# Altium schematic sheet Mellon-1.SchDoc
size 594 x 420 mm; ApprovedBy: Лазарев В.П.; DrawnBy: Лазарев В.П.; SheetTotal: 1; PageSetup: Record=PageOptions|CenterHorizontal=True|CenterVertical=True|PrintScale=1.00|XCorrection=1.00|YCorrection=1.00|PrintKind=0|BorderSize=5000000|LeftOffset=0|BottomOffset=0|Orientation=2|PaperLength=1000|PaperWidth=1000|Scale=100|PaperSource=260|PrintQuality=600|MediaType=1|DitherType=10|PaperKind=A3|PrintScaleMode=0
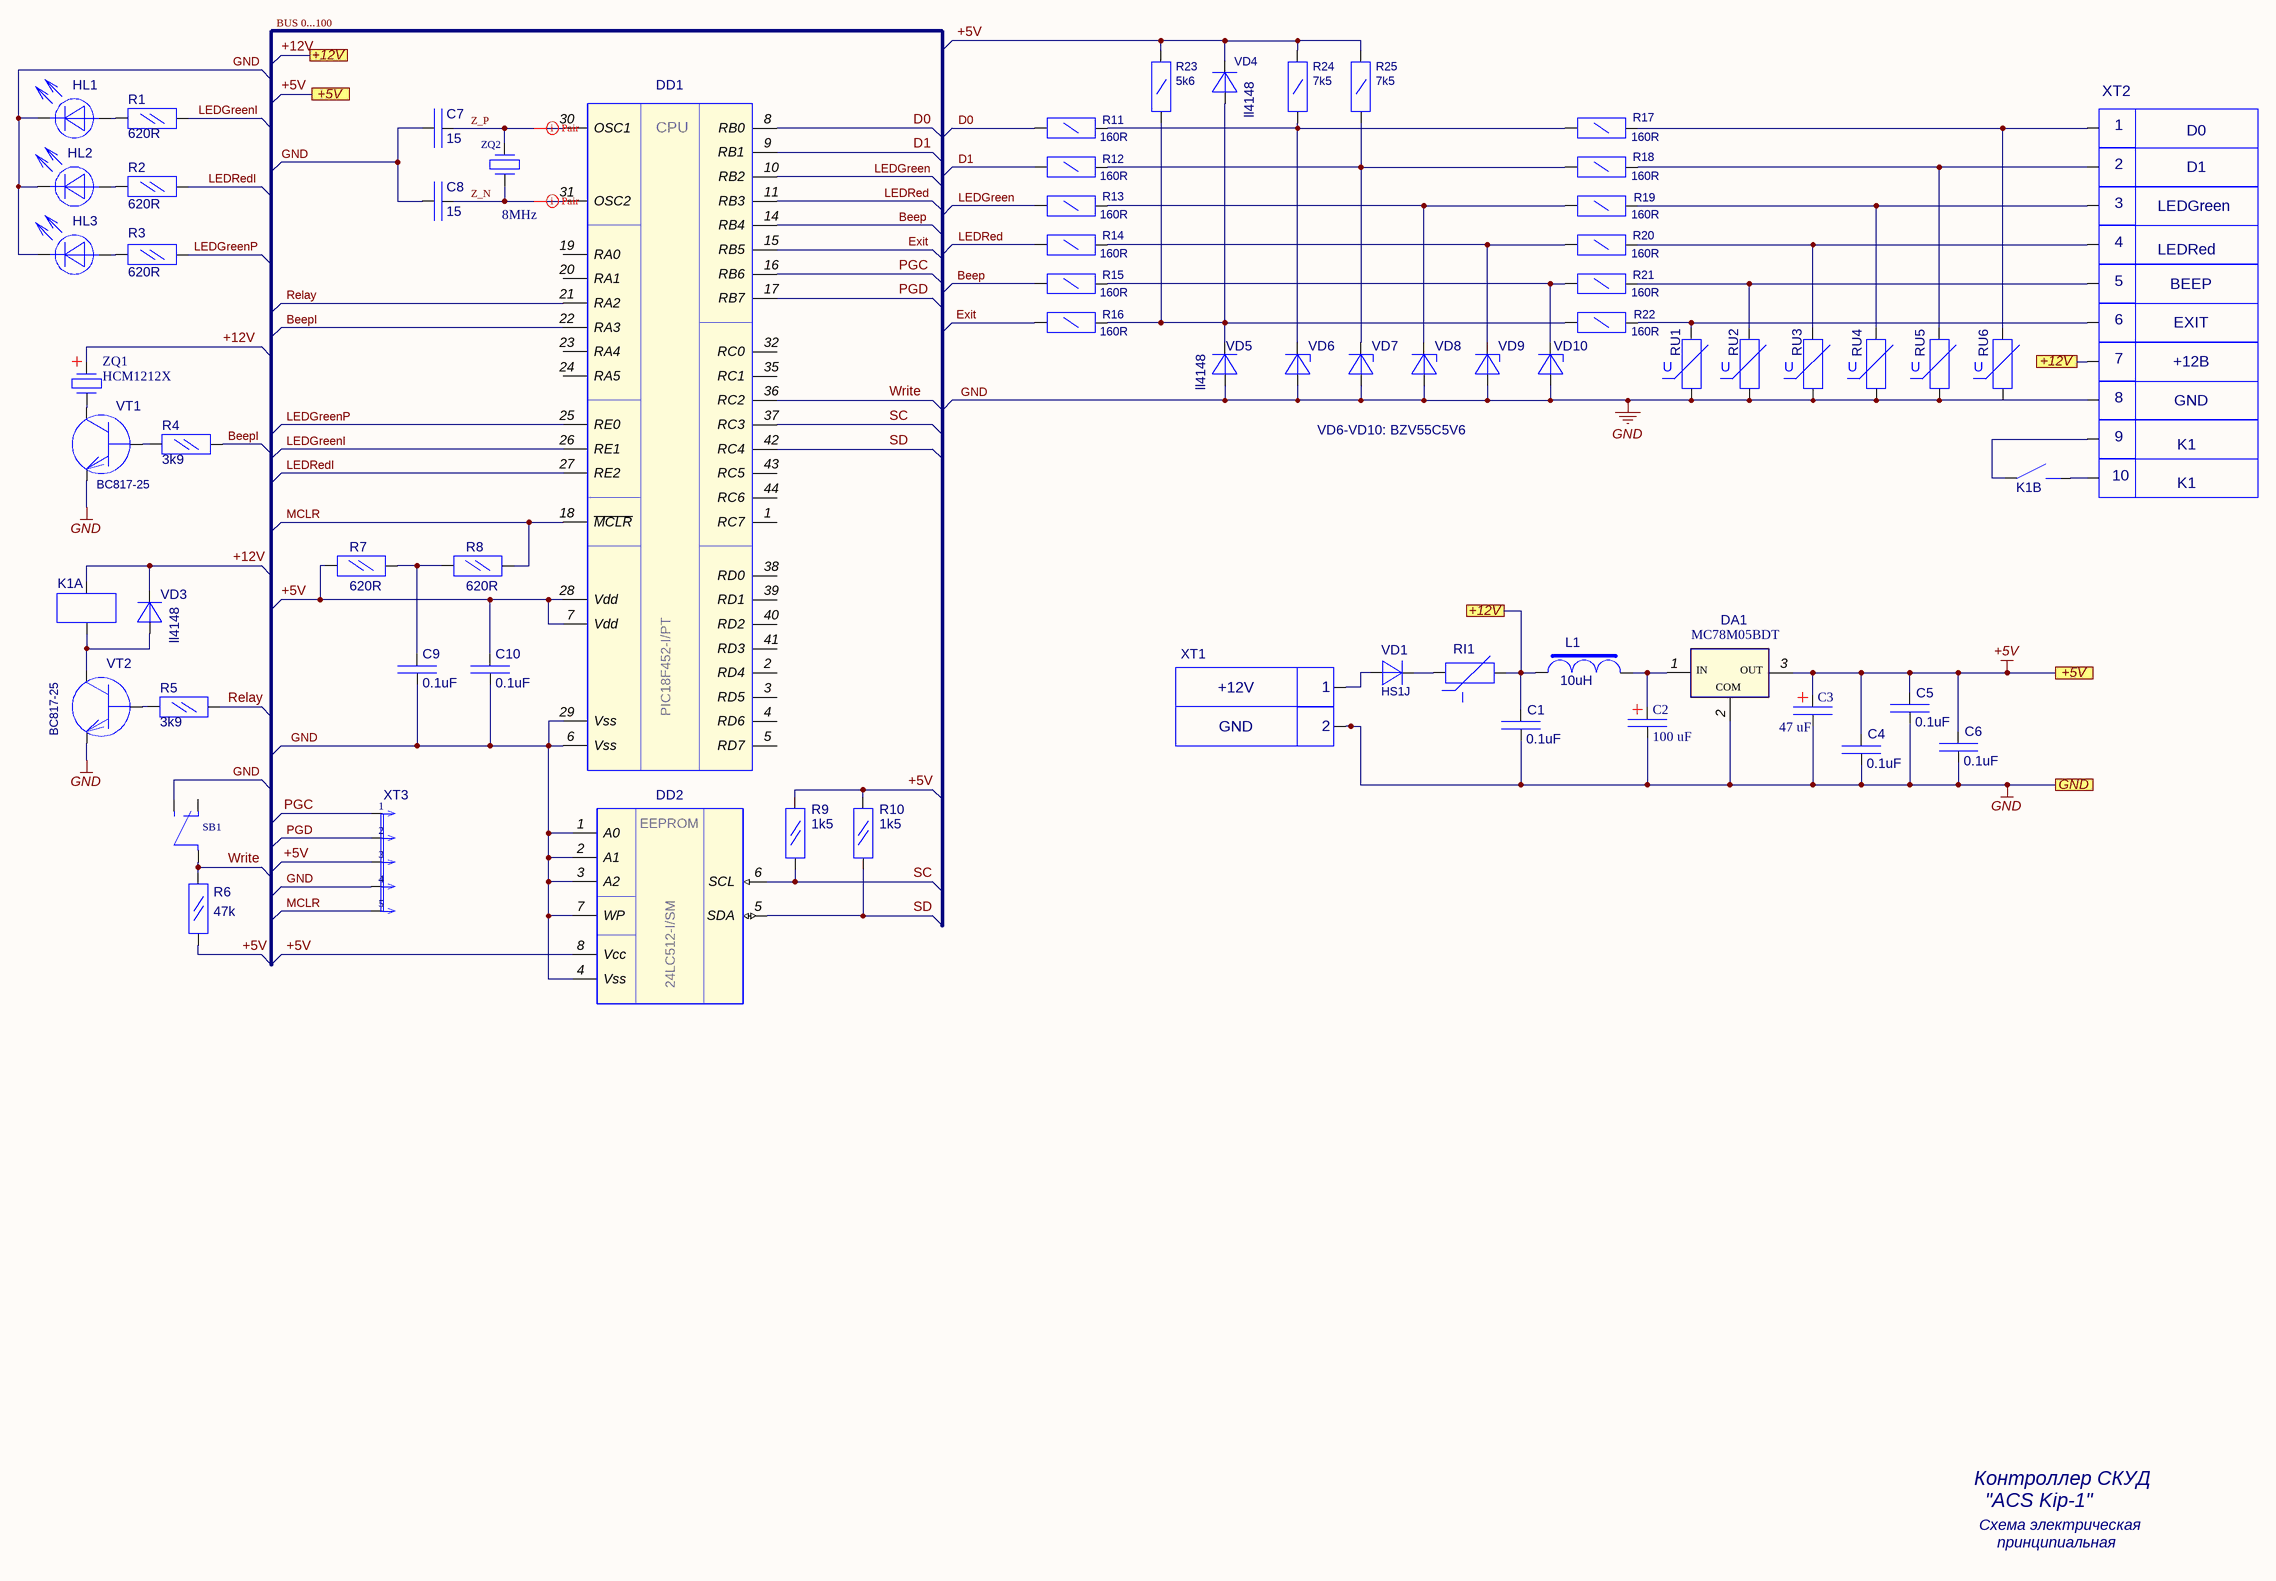
[diagram p0: Mellon-1.SchDoc]

## Parts
C1  value 0.1uF  [CAPC2012 (0805)]  (hidden comment: Cap1)
C2  value 100 uF  [CAPR E 6.5x12, pitch 2.5]  (hidden comment: Comment)
C3  value 47 uF  [CAPR E 6.5x12, pitch 2.5]  (hidden comment: Comment)
C4  value 0.1uF  [CAPC2012 (0805)]  (hidden comment: Cap1)
C5  value 0.1uF  [CAPC2012 (0805)]  (hidden comment: Cap1)
C6  value 0.1uF  [CAPC2012 (0805)]  (hidden comment: Cap1)
C7  value 15  [1608[0603]]  (hidden comment: Cap_SMD)
C8  value 15  [1608[0603]]  (hidden comment: Cap_SMD)
C9  value 0.1uF  [CAPC2012 (0805)]  (hidden comment: Cap_SMD)
C10  value 0.1uF  [CAPC2012 (0805)]  (hidden comment: Cap_SMD)
DA1  MC78M05BDT  [D3PAK]
DD1  PIC18F452-I/PT  [TQFP-PT44_M]
DD2  24LC512-I/SM  [SO8_W]
HL1  LED Green  [LED Green smd-1206]  (value not drawn)
HL2  LED Red  [LED Red smd-1206]  (value not drawn)
HL3  LED Green  [LED Green smd-1206]  (value not drawn)
K1  Relay  [Relay TRC-12VDC-SB-AL]  (value not drawn)  (parts A,B of 2)
L1  Inductance: 10uH  [Choke SMD 1812]  (hidden comment: Choke SMD)
R1  value 620R  [RESC2012(0805)]  (hidden comment: Res 1/8W)
R2  value 620R  [RESC2012(0805)]  (hidden comment: Res 1/8W)
R3  value 620R  [RESC2012(0805)]  (hidden comment: Res 1/8W)
R4  value 3k9  [RESC2012(0805)]  (hidden comment: Res 1/8W)
R5  value 3k9  [RESC2012(0805)]  (hidden comment: Res 1/8W)
R6  value 47k  [RESC2012(0805)]  (hidden comment: Res 1/8W)
R7  value 620R  [RESC2012(0805)]  (hidden comment: Res 1/8W)
R8  value 620R  [RESC2012(0805)]  (hidden comment: Res 1/8W)
R9  value 1k5  [RESC2012(0805)]  (hidden comment: Res 1/8W)
R10  value 1k5  [RESC2012(0805)]  (hidden comment: Res 1/8W)
R11  value 160R  [RESC3216(1206)N]  (hidden comment: Res 1/4W)
R12  value 160R  [RESC3216(1206)N]  (hidden comment: Res 1/4W)
R13  value 160R  [RESC3216(1206)N]  (hidden comment: Res 1/4W)
R14  value 160R  [RESC3216(1206)N]  (hidden comment: Res 1/4W)
R15  value 160R  [RESC3216(1206)N]  (hidden comment: Res 1/4W)
R16  value 160R  [RESC3216(1206)N]  (hidden comment: Res 1/4W)
R17  value 160R  [RESC3216(1206)N]  (hidden comment: Res 1/4W)
R18  value 160R  [RESC3216(1206)N]  (hidden comment: Res 1/4W)
R19  value 160R  [RESC3216(1206)N]  (hidden comment: Res 1/4W)
R20  value 160R  [RESC3216(1206)N]  (hidden comment: Res 1/4W)
R21  value 160R  [RESC3216(1206)N]  (hidden comment: Res 1/4W)
R22  value 160R  [RESC3216(1206)N]  (hidden comment: Res 1/4W)
R23  value 5k6  [RESC3216(1206)N]  (hidden comment: Res 1/4W)
R24  value 7k5  [RESC3216(1206)N]  (hidden comment: Res 1/4W)
R25  value 7k5  [RESC3216(1206)N]  (hidden comment: Res 1/4W)
RI1  MF-MSMF010  [Multy_Fuse 1812]  (value not drawn)
RU1  Varistor  [CAPC3216N]  (value not drawn)
RU2  Varistor  [CAPC3216N]  (value not drawn)
RU3  Varistor  [CAPC3216N]  (value not drawn)
RU4  Varistor  [CAPC3216N]  (value not drawn)
RU5  Varistor  [CAPC3216N]  (value not drawn)
RU6  Varistor  [CAPC3216N]  (value not drawn)
SB1  SW-2WAY_Gost  [PLS 2pin]  (value not drawn)
VD1  value HS1J  [CD4532-1812 (mod)]  (hidden comment: Diode1)
VD3  value ll4148  [MELF-D3516-1406]  (hidden comment: Diode LL4148)
VD4  value ll4148  [MELF-D3516-1406]  (hidden comment: Diode LL4148)
VD5  value ll4148  [MELF-D3516-1406]  (hidden comment: Diode LL4148)
VD6  Diode Zener  [SOD80 (miniMELF]  (value not drawn)
VD7  Diode Zener  [SOD80 (miniMELF]  (value not drawn)
VD8  Diode Zener  [SOD80 (miniMELF]  (value not drawn)
VD9  Diode Zener  [SOD80 (miniMELF]  (value not drawn)
VD10  Diode Zener  [SOD80 (miniMELF]  (value not drawn)
VT1  value BC817-25  [SOT-23_3D]  (hidden comment: BC847)
VT2  value BC817-25  [SOT-23_3D]  (hidden comment: BC847)
X2.2  Connect x2_1  [ZIP-Ballast2 - screw 3.5]  (value not drawn)
XT1  Connect x2_1  [ZIP-Ballast2]  (value not drawn)
XT2  Connect x2  [ZIP-Ballast2 - screw 3.5]  (value not drawn)
XT2.1  Connect x2_1  [ZIP-Ballast2 - screw 3.5]  (value not drawn)
XT2.3  Connect x2_1  [ZIP-Ballast2 - screw 3.5]  (value not drawn)
XT2.4  Connect x2_1  [ZIP-Ballast2]  (value not drawn)
XT3  Connect x5  [Connector PLS 5pin]  (value not drawn)
ZQ1  value HCM1212X  [HCM1606X]  (hidden comment: Buzzer)
ZQ2  value 8MHz  [HC-49sm]  (hidden comment: XTAL_1)

## Ports
+5V, +12V, GND

## Nets
+5V: C3.1 C4.2 C5.2 C6.2 C10.2 DA1.3(OUT) DD1.7(Vdd) DD1.28(Vdd) DD2.8(Vcc) R6.2 R7.2 R9.1 R10.1 R23.1 R24.1 R25.1 VD4.2 XT3.3 ; port +5V
GND: C1.1 C2.2 C3.2 C4.1 C5.1 C6.1 C7.1 C8.1 C9.1 C10.1 DA1.2(COM) DD1.6(Vss) DD1.29(Vss) DD2.1(A0) DD2.2(A1) DD2.3(A2) DD2.4(Vss) DD2.7(WP) HL1.2 HL2.2 HL3.2 RU1.1 RU2.1 RU3.1 RU4.1 RU5.1 RU6.1 SB1.2(NO) VD5.1 VD6.1 VD7.1 VD8.1 VD9.1 VD10.1 VT1.2(E) VT2.2(E) XT1.2 XT2.3.2 XT3.4 ; port GND
+12V: C1.2 K1.4 L1.2 RI1.1 VD3.2 XT2.3.1 ZQ1.1(OSC1) ; port +12V
Beep: DD1.14(RB4) R15.2
BeepI: DD1.22(RA3) R4.2
D0: DD1.8(RB0) R11.2
D1: DD1.9(RB1) R12.2
Exit: DD1.15(RB5) R16.2
LEDGreen: DD1.10(RB2) R13.2
LEDGreenI: DD1.26(RE1) R1.2
LEDGreenP: DD1.25(RE0) R3.2
LEDRed: DD1.11(RB3) R14.2
LEDRedI: DD1.27(RE2) R2.2
MCLR: DD1.18(~{MCLR}) R8.1 XT3.5
PGC: DD1.16(RB6) XT3.1
PGD: DD1.17(RB7) XT3.2
Relay: DD1.21(RA2) R5.2
SC: DD1.37(RC3) DD2.6(SCL) R9.2
SD: DD1.42(RC4) DD2.5(SDA) R10.2
Write: DD1.36(RC2) R6.1 SB1.1(C)
Z_N: C8.2 DD1.31(OSC2) ZQ2.1(OSC1)
Z_P: C7.2 DD1.30(OSC1) ZQ2.2(OSC2)
NetC2_1: C2.1 DA1.1(IN) L1.1
NetC9_2: C9.2 R7.1 R8.2
NetHL1_1: HL1.1 R1.1
NetHL2_1: HL2.1 R2.1
NetHL3_1: HL3.1 R3.1
NetK1_1: K1.1 XT2.4.1
NetK1_2: K1.2 XT2.4.2
NetK1_3: K1.3 VD3.1 VT2.3(C)
NetR4_1: R4.1 VT1.1(B)
NetR5_1: R5.1 VT2.1(B)
NetR11_1: R11.1 R17.2 R24.2 VD6.2
NetR12_1: R12.1 R18.2 R25.2 VD7.2
NetR13_1: R13.1 R19.2 VD8.2
NetR14_1: R14.1 R20.2 VD9.2
NetR15_1: R15.1 R21.2 VD10.2
NetR16_1: R16.1 R22.2 R23.2 VD4.1 VD5.2
NetR17_1: R17.1 RU6.2 XT2.1
NetR18_1: R18.1 RU5.2 XT2.2
NetR19_1: R19.1 RU4.2 XT2.1.1
NetR20_1: R20.1 RU3.2 XT2.1.2
NetR21_1: R21.1 RU2.2 X2.2.1
NetR22_1: R22.1 RU1.2 X2.2.2
NetRI1_2: RI1.2 VD1.2
NetVD1_1: VD1.1 XT1.1
NetVT1_3: VT1.3(C) ZQ1.2(OSC2)

Not connected (* = marked no-connect by the designer): DD1 1(RC7) 2(RD4) 3(RD5) 4(RD6) 5(RD7) 19(RA0) 20(RA1) 23(RA4) 24(RA5) 32(RC0) 35(RC1) 38(RD0) 39(RD1) 40(RD2) 41(RD3) 43(RC5) 44(RC6); SB1 3(NC)

## Buses and harness runs
bus BUS 0...100

## Layout directives
differential pair: Z_N, Z_P

## Notes on the sheet
- (near XT2) 1
- D0
- (near XT2) 2
- (near XT2.1) 3
- LEDGreen
- D1
- (near XT2.1) 4
- LEDRed
- (near X2.2) 5
- (near X2.2) 6
- EXIT
- BEEP
- (near XT2.3) 7
- +12B
- VD6-VD10: BZV55C5V6
- (near XT2.3) 8
- (near XT2.4) 9
- K1
- GND
- (near XT2.4) 10
- +12V
- (near XT1) 1
- (near XT1) 2
- Контроллер СКУД
  "ACS Kip-1"
- Схема электрическая
  принципиальная
- Подп. дата
- Инв. № дубл.
- Взам. инв. №
- Подп. и дата
- Изм.
- Лист.
- № докум.
- Подп.
- Дата
- Лит.
- Масса
- Масштаб
- Разраб.
- Пров.
- Т. контр.
- Лист 1
- Листов
- 1:1
- Инв. № подп.
- Н. контр.
- Утв.
- Формат А2
- (in symbol PIC18F452-I/PT) CPU
- (in symbol Varistor) U

## Library data of the parts
C1 C4-C6 = Cap1: Capacitor GOST; Voltage: 100 V; Function: CVCC; Dielectric: Y5V; Tolerance: 5%/10%; PackageDescription: Chip Capasitor; Package Reference: C0805
C2 = Cap Pol: Cap Pol GOST; Tolerance: 10%; Function: Electrolytic Aluminum Capasitor; Voltage: 35V; Supplier: *; PackageDescription: Radial, Thru-Hole Body 13.0x25.0 (DxH)mm, Pin Spacing 5.0mm
C3 = Cap Pol: Cap Pol GOST; Tolerance: 10%; Function: Electrolytic Aluminum Capasitor; Voltage: 16V; Supplier: *; PackageDescription: Radial, Thru-Hole Body 13.0x25.0 (DxH)mm, Pin Spacing 5.0mm
C7 C8 = Cap_SMD: Ceramic; Voltage: 15V; Tolerance %: 1%; Dielectric: NPO; Value2: 220-470nF; PackageDescription: SMD CC0603; Function: *; Supplier: *; Supplier Part Number: *
C9 C10 = Cap_SMD: Ceramic; Voltage: 15V; Tolerance %: 10%; Dielectric: Y5V; Value2: 220-470nF; PackageDescription: SMD CC0805; Function: *; Supplier: *; Supplier Part Number: *
DA1 = MC78M05BDT: Voltage Regulator Gost; Functuion: Positive Voltage Regulator; Value: MC78M05BDT; PackageReference: *
DD1 = PIC18F452-I/PT: 44pin TQFP; Functuion: MCU; PackageReference: TQFP; Supplier 1: Microchip Technology Inc; Value: PIC18F452-I/PT
DD2 = 24LC512-I/SM: Function: EEPROM; Supplier: Microchip Technology Inc; Value: 24LC512-I/SM
HL1 HL3 = LED Green: LED Gost; Value: KA-3021SGC; PackageDescription: SMD 2x3mm; Color: Green
HL2 = LED Red: LED Gost; Value: KA-3021SRC; PackageDescription: SMD 2x3mm; Color: Red
K1 = Relay: TRC-12VDC-FB-AL; Function: Relay 1 pole; Value: TRC-12VDC-SB-AL
L1 = Choke SMD: Value: CM453232-100KL; Function: Choke; Package: SMD 1812
R1-R3 R6-R8 = Res 1/8W: Resistor GOST; Tolerance: 10%; PackageDescription: Chip Resistor, Body 2.0x1.3mm,; PackageReference: *; Part Number: *
R4 R5 R9 R10 = Res 1/8W: Resistor GOST; Tolerance: 1%; PackageDescription: Chip Resistor, Body 2.0x1.3mm,; PackageReference: *; Part Number: *
R11-R25 = Res 1/4W: Resistor GOST; PackageDescription: SMD 2106; Function: *; Part Number: *
RI1 = MF-MSMF010: MultiFuse; Value: MF-MSMF110; Current hold: 200 mA; Function: MultiFuse; Package: SMD 1812
RU1-RU6 = Varistor: Varistor GOST; Value: CN1812K30G; PackageReference: *; PackageDescription: SMD 1812; Part Number: *; Function: Varistor
SB1 = SW-2WAY_Gost: SM-07-P (PRESSED); Value: *
VD1 = Diode1: Diode GOST; Part Number: *; PackageDescription: Chip Diode; Body 4.5 x 3.2 mm (LxW typ); PackageReference: *; Function: *
VD3-VD5 = Diode LL4148: Diode LL4148 (GOST); Package Description: miniMELF (SOD-80); Part Number: *; Function: *
VD6-VD10 = Diode Zener: Diode Zener GOST; Function: Zener Diod 5V6; Value: BZV55C5V6; Part Number: *; PackageReference: *; PackageDescription: miniMELF (SOD-80)
VT1 VT2 = BC847: NPN_SOT23; Functioun: Bipolar NPN; Vceo=40V; Ic=600mA; PackageDescription: SOT-23; PackageReference: *; Part Number: *
X2.2 XT1 XT2 XT2.1 XT2.3 XT2.4 = Connect x2_1: Connect x2 GOST
XT3 = Connect x5: PLS 5 pin; Package: PLS 5pin
ZQ1 = Buzzer: Sound Buzzer
ZQ2 = XTAL_1: Crystal Oscillator_Gost; PackageReference: HC-49sm